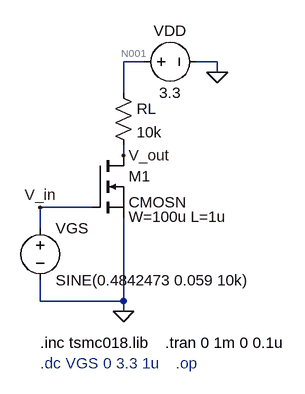
[diagram p0: schematic arjun.asc]
arjun.asc, the LTspice schematic file:
Version 4.1
SHEET 1 880 680
WIRE 336 112 304 112
WIRE 448 112 416 112
WIRE 448 128 448 112
WIRE 304 160 304 112
WIRE 304 256 304 240
WIRE 256 336 176 336
WIRE 176 368 176 336
WIRE 176 480 176 448
WIRE 304 480 304 352
WIRE 304 480 176 480
WIRE 304 496 304 480
FLAG 448 128 0
FLAG 304 496 0
FLAG 176 336 V_in
FLAG 304 256 V_out
SYMBOL nmos 256 256 R0
WINDOW 123 56 94 Left 2
SYMATTR Value2 W=100u L=1u
SYMATTR InstName M1
SYMATTR Value CMOSN
SYMBOL Res 288 144 R0
SYMATTR InstName RL
SYMATTR Value 10k
SYMBOL Voltage 320 112 R270
WINDOW 0 32 56 VTop 2
WINDOW 3 -32 56 VBottom 2
SYMATTR InstName VDD
SYMATTR Value 3.3
SYMBOL Voltage 176 352 R0
SYMATTR InstName VGS
SYMATTR Value SINE(0.4842473 0.059 10k)
TEXT 176 544 Left 2 !.inc tsmc018.lib
TEXT 176 576 Left 2 ;.dc VGS 0 3.3 1u
TEXT 368 544 Left 2 !.tran 0 1m 0 0.1u
TEXT 384 576 Left 2 ;.op

The netlist it stands for:
* arjun.asc
M1 V_out V_in 0 0 CMOSN W=100u L=1u
RL N001 V_out 10k
VDD N001 0 3.3
VGS V_in 0 SINE(0.4842473 0.059 10k)
.model NMOS NMOS
.model PMOS PMOS
.lib standard.mos
.inc tsmc018.lib
* .dc VGS 0 3.3 1u
.tran 0 1m 0 0.1u
* .op
.backanno
.end

* Results of the author's LTspice run, read from the files saved beside the schematic
* Operating Point, zero values left out:
*   V(v_in) = 484.2 mV
*   V(v_out) = 2.263 V
*   V(n001) = 3.3 V
*   Id(M1) = 103.7 µA
*   Is(M1) = -103.7 µA
*   Ib(M1) = -2.273 pA
*   I(VDD) = -103.7 µA
*   I(RL) = 103.7 µA
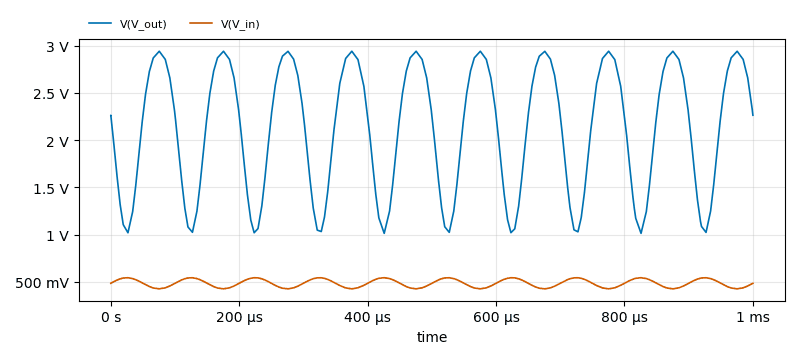
[diagram p1: Transient Analysis of arjun.asc, plotted from the saved traces]
* Transient Analysis, 1 run:
*   V(V_out): min 1.013 V, max 2.941 V, average 2.116 V, rms 2.224 V, last 2.263 V
*   V(V_in): min 425.3 mV, max 543.2 mV, average 484.5 mV, rms 486.2 mV, last 484.2 mV